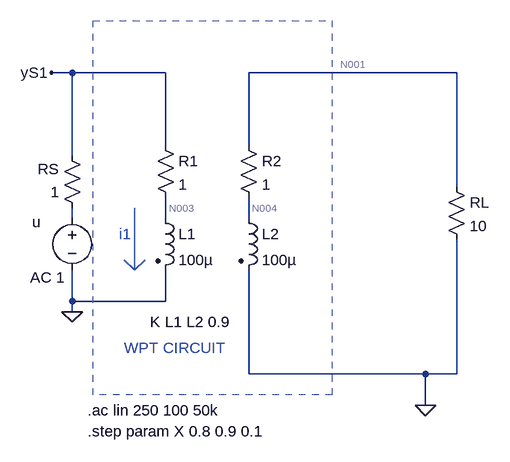
[diagram p0: schematic circuit-sch.asc]
circuit-sch.asc, the LTspice schematic file:
Version 4
SHEET 1 1704 680
WIRE -32 -80 -64 -80
WIRE 112 -80 -32 -80
WIRE 560 -80 240 -80
WIRE 112 32 112 -80
WIRE 240 32 240 -80
WIRE -32 48 -32 -80
WIRE 560 96 560 -80
WIRE -32 144 -32 128
WIRE 112 144 112 112
WIRE 240 144 240 112
WIRE -32 272 -32 224
WIRE 112 272 112 224
WIRE 112 272 -32 272
WIRE -32 288 -32 272
WIRE 240 384 240 224
WIRE 512 384 240 384
WIRE 560 384 560 176
WIRE 560 384 512 384
WIRE 512 432 512 384
FLAG -32 288 0
FLAG -64 -80 yS1
FLAG 512 432 0
SYMBOL res -16 144 R180
WINDOW 0 36 76 Left 2
WINDOW 3 36 40 Left 2
SYMATTR InstName RS
SYMATTR Value 1
SYMBOL ind2 96 128 R0
SYMATTR InstName L1
SYMATTR Value 100µ
SYMATTR Type ind
SYMBOL ind2 224 128 R0
SYMATTR InstName L2
SYMATTR Value 100µ
SYMATTR Type ind
SYMBOL res 96 16 R0
SYMATTR InstName R1
SYMATTR Value 1
SYMBOL res 224 16 R0
SYMATTR InstName R2
SYMATTR Value 1
SYMBOL voltage -32 128 R0
WINDOW 3 24 44 Invisible 2
WINDOW 123 -65 107 Left 2
WINDOW 39 0 0 Left 0
WINDOW 0 -62 22 Left 2
SYMATTR Value PULSE(0 8 0 1p 1p 8.62e-6 1.7241e-5)
SYMATTR Value2 AC 1
SYMATTR InstName u
SYMBOL res 544 80 R0
SYMATTR InstName RL
SYMATTR Value 10
TEXT 88 304 Left 2 !K L1 L2 0.9
TEXT 40 168 Left 2 ;i1
TEXT 48 344 Left 2 ;WPT CIRCUIT
TEXT -8 440 Left 2 !.ac lin 250 100 50k
TEXT -8 472 Left 2 !.step param X 0.8 0.9 0.1
LINE Normal 64 224 64 128
LINE Normal 48 208 64 224
LINE Normal 64 224 48 208
LINE Normal 80 208 64 224
RECTANGLE Normal 368 416 0 -160 2

The netlist it stands for:
* circuit-sch.asc
RS N002 yS1 1
L1 N003 0 100µ
L2 N004 0 100µ
R1 yS1 N003 1
R2 N001 N004 1
V§u N002 0 PULSE(0 8 0 1p 1p 8.62e-6 1.7241e-5) AC 1
RL N001 0 10
K L1 L2 0.9
* i1
* WPT CIRCUIT
.ac lin 250 100 50k
.step param X 0.8 0.9 0.1
.backanno
.end

* Results of the author's LTspice run, read from the files saved beside the schematic
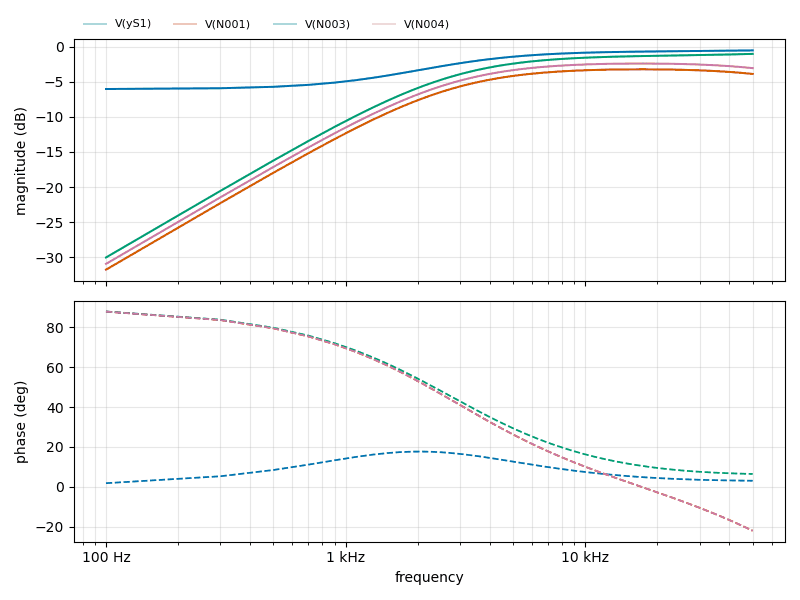
[diagram p1: AC Analysis of circuit-sch.asc, plotted from the saved traces]
* AC Analysis, 2 runs:
*   V(yS1) [x=0.8]: -6.01 dB at 100 Hz, -0.49 dB at 50 kHz, peak -0.49 dB at 50 kHz, 3 dB below the peak at 1.878 kHz
*   V(yS1) [x=0.9]: -6.01 dB at 100 Hz, -0.49 dB at 50 kHz, peak -0.49 dB at 50 kHz, 3 dB below the peak at 1.878 kHz
*   V(N001) [x=0.8]: -31.81 dB at 100 Hz, -3.85 dB at 50 kHz, peak -3.19 dB at 17.13 kHz, 3 dB below the peak at 2.632 kHz
*   V(N001) [x=0.9]: -31.81 dB at 100 Hz, -3.85 dB at 50 kHz, peak -3.19 dB at 17.13 kHz, 3 dB below the peak at 2.632 kHz
*   V(N003) [x=0.8]: -30.06 dB at 100 Hz, -0.99 dB at 50 kHz, peak -0.99 dB at 50 kHz, 3 dB below the peak at 2.923 kHz
*   V(N003) [x=0.9]: -30.06 dB at 100 Hz, -0.99 dB at 50 kHz, peak -0.99 dB at 50 kHz, 3 dB below the peak at 2.923 kHz
*   V(N004) [x=0.8]: -30.98 dB at 100 Hz, -3.03 dB at 50 kHz, peak -2.37 dB at 17.13 kHz, 3 dB below the peak at 2.632 kHz
*   V(N004) [x=0.9]: -30.98 dB at 100 Hz, -3.03 dB at 50 kHz, peak -2.37 dB at 17.13 kHz, 3 dB below the peak at 2.632 kHz